# EAGLE design W077 (EAGLE 4.11)
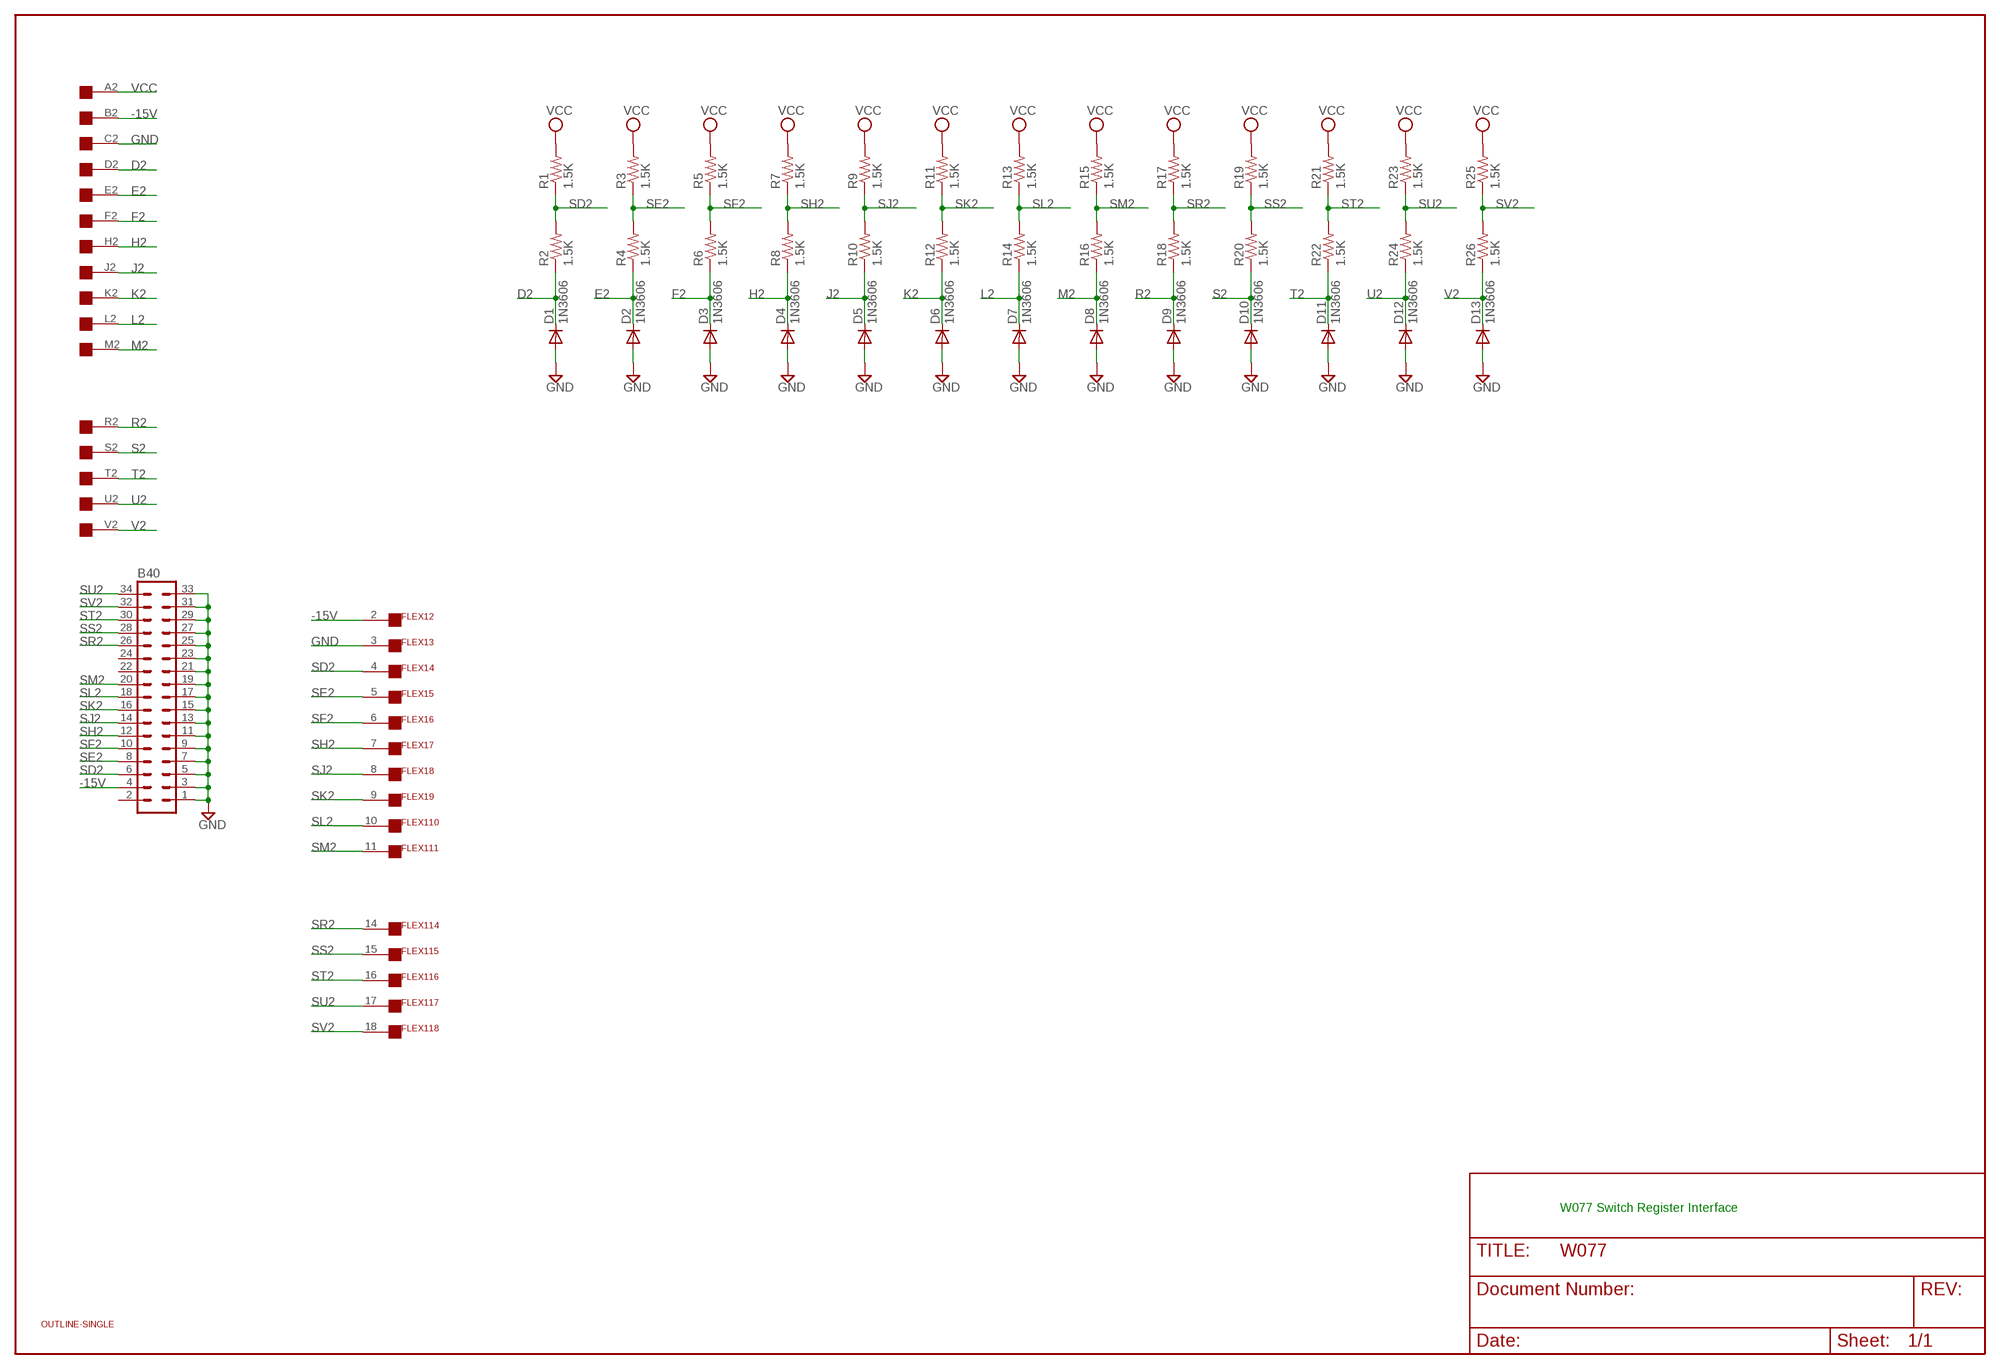
[diagram p0: schematic, sheet 1]

## Parts
B40  MA17-2  [MA17-2]
D1  1N3606  1N4148  [DO35-10]
D2  1N3606  1N4148  [DO35-10]
D3  1N3606  1N4148  [DO35-10]
D4  1N3606  1N4148  [DO35-10]
D5  1N3606  1N4148  [DO35-10]
D6  1N3606  1N4148  [DO35-10]
D7  1N3606  1N4148  [DO35-10]
D8  1N3606  1N4148  [DO35-10]
D9  1N3606  1N4148  [DO35-10]
D10  1N3606  1N4148  [DO35-10]
D11  1N3606  1N4148  [DO35-10]
D12  1N3606  1N4148  [DO35-10]
D13  1N3606  1N4148  [DO35-10]
FLEX1  FLEX19  [FLEX19]
R1  1.5K  R-US_0207/10  [0207/10]
R2  1.5K  R-US_0207/10  [0207/10]
R3  1.5K  R-US_0207/10  [0207/10]
R4  1.5K  R-US_0207/10  [0207/10]
R5  1.5K  R-US_0207/10  [0207/10]
R6  1.5K  R-US_0207/10  [0207/10]
R7  1.5K  R-US_0207/10  [0207/10]
R8  1.5K  R-US_0207/10  [0207/10]
R9  1.5K  R-US_0207/10  [0207/10]
R10  1.5K  R-US_0207/10  [0207/10]
R11  1.5K  R-US_0207/10  [0207/10]
R12  1.5K  R-US_0207/10  [0207/10]
R13  1.5K  R-US_0207/10  [0207/10]
R14  1.5K  R-US_0207/10  [0207/10]
R15  1.5K  R-US_0207/10  [0207/10]
R16  1.5K  R-US_0207/10  [0207/10]
R17  1.5K  R-US_0207/10  [0207/10]
R18  1.5K  R-US_0207/10  [0207/10]
R19  1.5K  R-US_0207/10  [0207/10]
R20  1.5K  R-US_0207/10  [0207/10]
R21  1.5K  R-US_0207/10  [0207/10]
R22  1.5K  R-US_0207/10  [0207/10]
R23  1.5K  R-US_0207/10  [0207/10]
R24  1.5K  R-US_0207/10  [0207/10]
R25  1.5K  R-US_0207/10  [0207/10]
R26  1.5K  R-US_0207/10  [0207/10]
U$1  OUTLINE-SINGLE  [SINGLE]
U$2  EDGE-1  [EDGE-CON1]

## Nets
-15V [supply]: B40.4 FLEX1.2 U$2.B2
D2: D1.C R2.1 U$2.D2
E2: D2.C R4.1 U$2.E2
F2: D3.C R6.1 U$2.F2
GND [supply]: B40.1 B40.3 B40.5 B40.7 B40.9 B40.11 B40.13 B40.15 B40.17 B40.19 B40.21 B40.23 B40.25 B40.27 B40.29 B40.31 B40.33 D1.A D2.A D3.A D4.A D5.A D6.A D7.A D8.A D9.A D10.A D11.A D12.A D13.A FLEX1.3 U$2.C2
H2: D4.C R8.1 U$2.H2
J2: D5.C R10.1 U$2.J2
K2: D6.C R12.1 U$2.K2
L2: D7.C R14.1 U$2.L2
M2: D8.C R16.1 U$2.M2
R2: D9.C R18.1 U$2.R2
S2: D10.C R20.1 U$2.S2
SD2: B40.6 FLEX1.4 R1.1 R2.2
SE2: B40.8 FLEX1.5 R3.1 R4.2
SF2: B40.10 FLEX1.6 R5.1 R6.2
SH2: B40.12 FLEX1.7 R7.1 R8.2
SJ2: B40.14 FLEX1.8 R9.1 R10.2
SK2: B40.16 FLEX1.9 R11.1 R12.2
SL2: B40.18 FLEX1.10 R13.1 R14.2
SM2: B40.20 FLEX1.11 R15.1 R16.2
SR2: B40.26 FLEX1.14 R17.1 R18.2
SS2: B40.28 FLEX1.15 R19.1 R20.2
ST2: B40.30 FLEX1.16 R21.1 R22.2
SU2: B40.34 FLEX1.17 R23.1 R24.2
SV2: B40.32 FLEX1.18 R25.1 R26.2
T2: D11.C R22.1 U$2.T2
U2: D12.C R24.1 U$2.U2
V2: D13.C R26.1 U$2.V2
VCC: R1.2 R3.2 R5.2 R7.2 R9.2 R11.2 R13.2 R15.2 R17.2 R19.2 R21.2 R23.2 R25.2 U$2.A2
Unconnected: B40.2 B40.22 B40.24 FLEX1.1 FLEX1.12 FLEX1.13 FLEX1.19 U$2.N2 U$2.P2

## Notes on the sheet
- W077 Switch Register Interface

## Library data of the parts
B40 = con-lstb:MA17-2: PIN HEADER
D1-D13 = diode:1N4148: DIODE high speed (Philips)
FLEX1 = dec-con:FLEX19
R1-R26 = rcl:R-US_: RESISTOR, American symbol
U$1 = dec-con:OUTLINE-*: Board outlines for DEC boards.
U$2 = dec-con:EDGE-1: Single-Sided DEC Edge Connector -- (side 2)

## Net classes
1 supply: width 0.762 mm

## Board
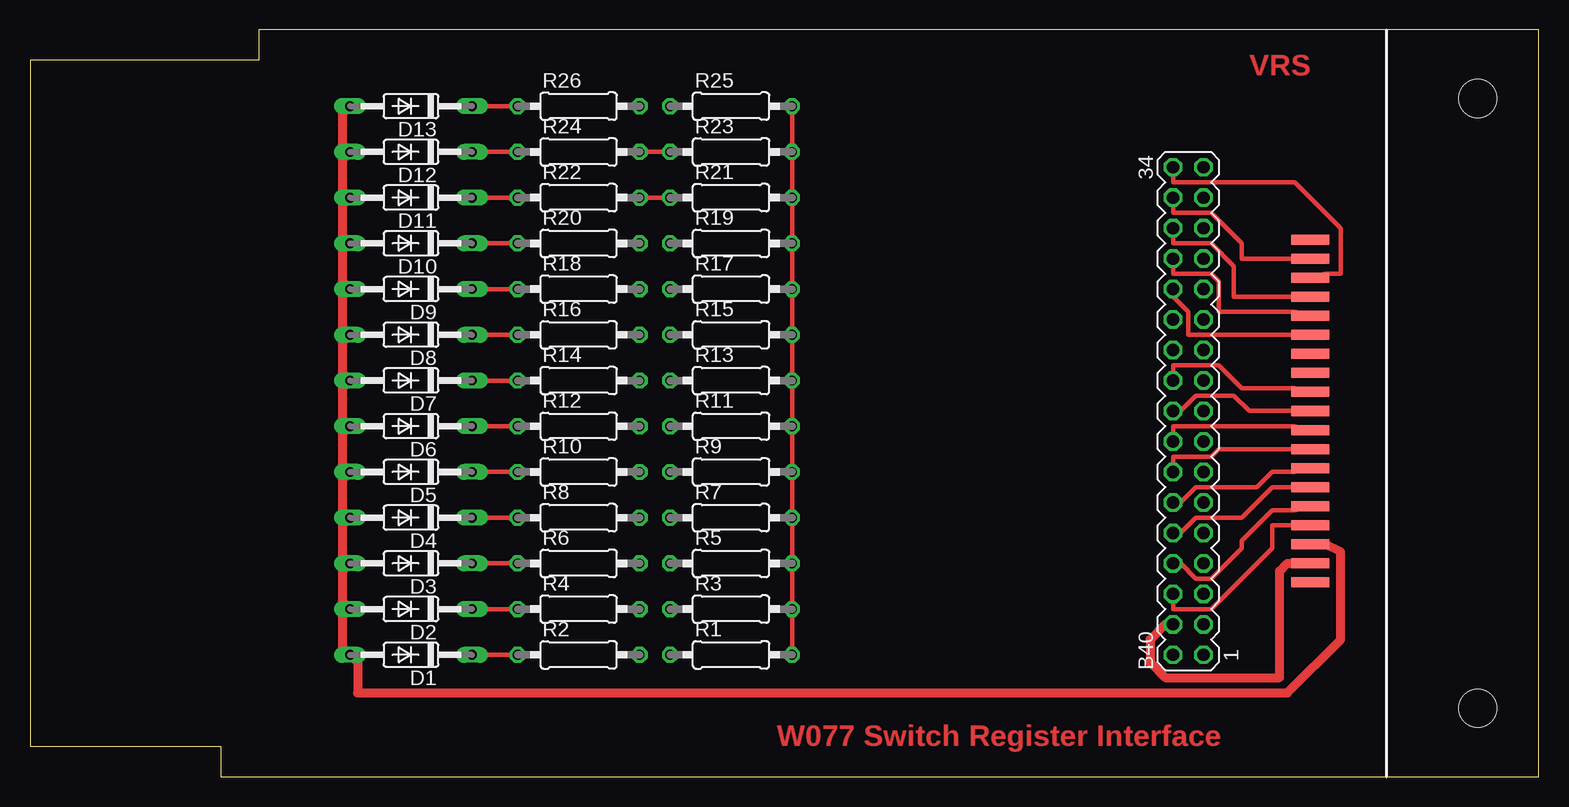
[diagram p1: board, top side]
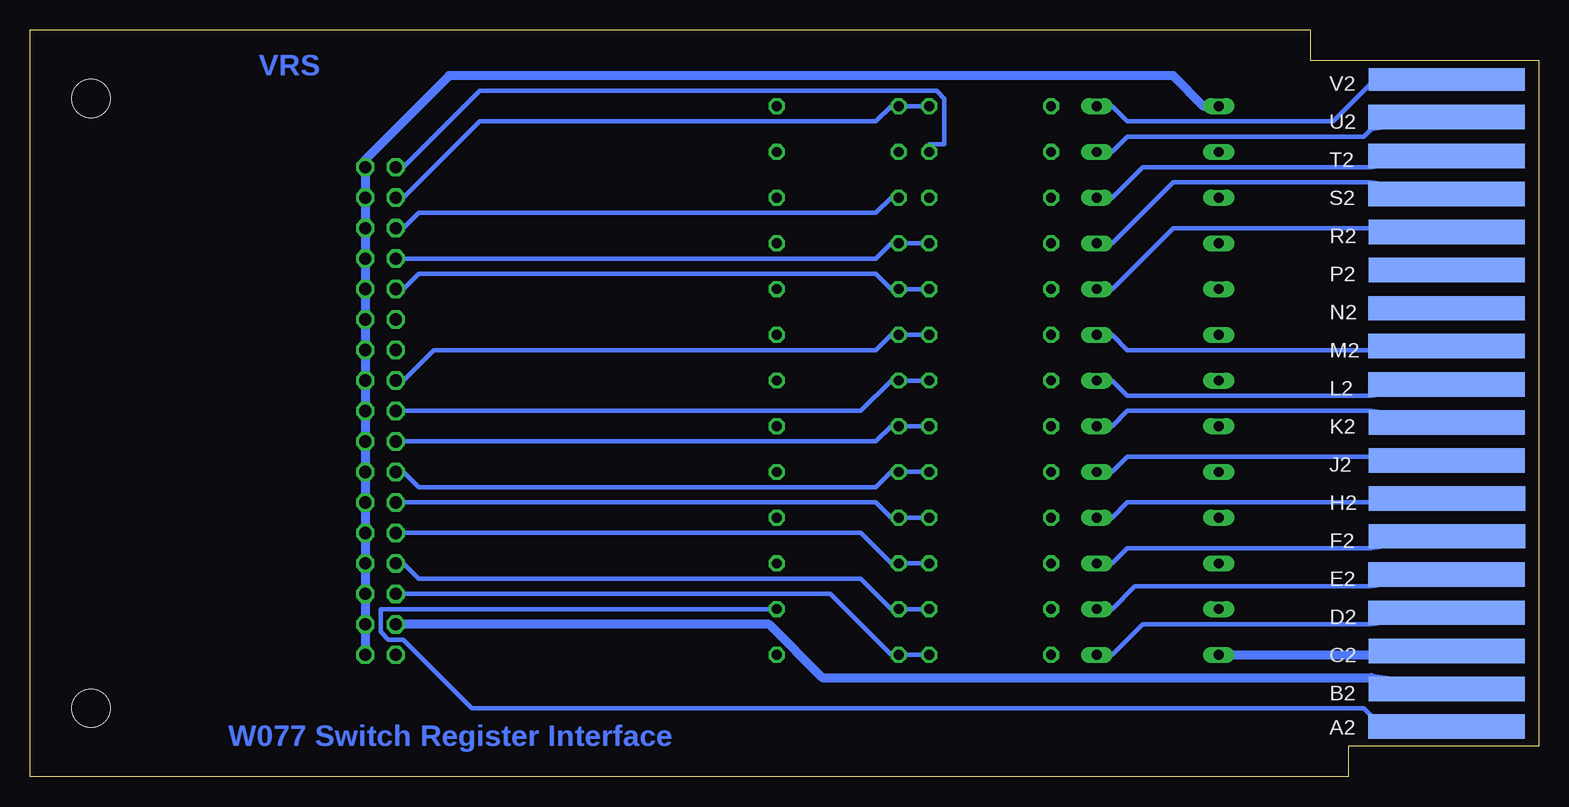
[diagram p2: board, bottom side, seen from below]

Size 125.73 x 62.23 mm. Coordinates in mm from the lower left corner, seen from the top.
Copper layers (1*16): Top 0.035mm / dielectric 1.5mm / Bottom 0.035mm
Design rules "15mils": minimum track width 15mil, minimum drill 24mil, track to track 15mil, track to pad 10mil, pad to pad 10mil, via to via 10mil, smd to smd 10mil, copper to edge 25mil, drill to drill 10mil, minimum pad ring 10mil, minimum via ring 8mil, stop-mask expansion 0mil, vias tented up to drill 0mil, thermal gap 10mil

### Footprints (pad centres in the part's own frame; a part is rotated, then mirrored left to right if it is on the bottom)
MA17-2 = drill 1.016 octagon: 1 -20.32,-1.27; 2 -20.32,1.27; 3 -17.78,-1.27; 4 -17.78,1.27; 5 -15.24,-1.27; 6 -15.24,1.27; 7 -12.7,-1.27; 8 -12.7,1.27; 9 -10.16,-1.27; 10 -10.16,1.27; 11 -7.62,-1.27; 12 -7.62,1.27; 13 -5.08,-1.27; 14 -5.08,1.27; 15 -2.54,-1.27; 16 -2.54,1.27; 17 0,-1.27; 18 0,1.27; 19 2.54,-1.27; 20 2.54,1.27; 21 5.08,-1.27; 22 5.08,1.27; 23 7.62,-1.27; 24 7.62,1.27; 25 10.16,-1.27; 26 10.16,1.27; 27 12.7,-1.27; 28 12.7,1.27; 29 15.24,-1.27; 30 15.24,1.27; 31 17.78,-1.27; 32 17.78,1.27; 33 20.32,-1.27; 34 20.32,1.27
DO35-10 = drill 0.813 long: A 5.08,0; C -5.08,0
FLEX19 = smd 3.175 x 0.838: 1 0,14.287; 2 0,12.7; 3 0,11.113; 4 0,9.525; 5 0,7.938; 6 0,6.35; 7 0,4.763; 8 0,3.175; 9 0,1.587; 10 0,0; 11 0,-1.587; 12 0,-3.175; 13 0,-4.763; 14 0,-6.35; 15 0,-7.938; 16 0,-9.525; 17 0,-11.113; 18 0,-12.7; 19 0,-14.287
0207/10 = drill 0.813 octagon: 1 -5.08,0; 2 5.08,0
SINGLE = hole 3.175: 120.65,56.515; 120.65,5.715
EDGE-CON1 = smd 13.017 x 2.032 bottom: A2 7.69,4.194; B2 7.668,7.328; C2 7.668,10.49; D2 7.693,13.665; E2 7.693,16.84; F2 7.642,20.041; H2 7.642,23.19; J2 7.668,26.34; K2 7.668,29.515; L2 7.693,32.69; M2 7.693,35.89; N2 7.693,39.04; P2 7.668,42.24; R2 7.668,45.39; S2 7.693,48.565; T2 7.693,51.74; U2 7.693,54.966 | smd 13.017 x 1.905 bottom: V2 7.668,58.102

### Placement (x,y rotation side)
B40  96.52,30.48 90 top
D1  31.75,10.16 180 top
D2  31.75,13.97 180 top
D3  31.75,17.78 180 top
D4  31.75,21.59 180 top
D5  31.75,25.4 180 top
D6  31.75,29.21 180 top
D7  31.75,33.02 180 top
D8  31.75,36.83 180 top
D9  31.75,40.64 180 top
D10  31.75,44.45 180 top
D11  31.75,48.26 180 top
D12  31.75,52.07 180 top
D13  31.75,55.88 180 top
FLEX1  106.68,30.48 180 top
R1  58.42,10.16 0 top
R2  45.72,10.16 0 top
R3  58.42,13.97 0 top
R4  45.72,13.97 0 top
R5  58.42,17.78 0 top
R6  45.72,17.78 0 top
R7  58.42,21.59 0 top
R8  45.72,21.59 0 top
R9  58.42,25.4 0 top
R10  45.72,25.4 0 top
R11  58.42,29.21 0 top
R12  45.72,29.21 0 top
R13  58.42,33.02 0 top
R14  45.72,33.02 0 top
R15  58.42,36.83 0 top
R16  45.72,36.83 0 top
R17  58.42,40.64 0 top
R18  45.72,40.64 0 top
R19  58.42,44.45 0 top
R20  45.72,44.45 0 top
R21  58.42,48.26 0 top
R22  45.72,48.26 0 top
R23  58.42,52.07 0 top
R24  45.72,52.07 0 top
R25  58.42,55.88 0 top
R26  45.72,55.88 0 top
U$1  0,0 0 top
U$2  0,0 0 top

### Tracks (layer width: path | path; a pad name or v marks a point on that pad's centre or on a via)
-15V
  Top 0.762: B40.4 94.62,12.7 93.35,11.43 93.35,9.53 94.62,8.26 104.14,8.26 104.14,17.14 104.78,17.78 105.41,17.78 FLEX1.2
  Bottom 0.762: B40.4 94.62,12.7 64.14,12.7 59.69,8.26 13.97,8.26 U$2.B2
D2
  Top 0.381: D1.C 38.1,10.16 40.01,10.16 R2.1
  Bottom 0.381: D1.C 35.56,10.16 33.02,12.7 13.97,12.7 U$2.D2
E2
  Top 0.381: D2.C 38.1,13.97 40.01,13.97 R4.1
  Bottom 0.381: D2.C 35.56,13.97 33.66,15.88 13.97,15.88 U$2.E2
F2
  Top 0.381: D3.C 38.1,17.78 40.01,17.78 R6.1
  Bottom 0.381: D3.C 35.56,17.78 34.29,19.05 13.97,19.05 U$2.F2
GND
  Top 0.762: D13.A 26.04,55.24 26.04,52.7 D12.A 26.04,51.44 26.04,48.9 D11.A 26.04,47.62 26.04,45.09 D10.A 26.04,43.81 26.04,41.27 D9.A 26.04,40.01 26.04,37.47 D8.A 26.04,36.2 26.04,33.66 D7.A 26.04,32.38 26.04,29.84 D6.A 26.04,28.57 26.04,26.04 D5.A 26.04,24.77 26.04,22.23 D4.A 26.04,20.95 26.04,18.41 D3.A 26.04,17.14 26.04,14.61 D2.A 26.04,13.34 26.04,10.79 D1.A 27.31,9.53 27.31,6.99 104.78,6.99 109.22,11.43 109.22,18.73 107.95,19.37 FLEX1.3
  Bottom 0.762: B40.1 97.79,10.79 97.79,12.06 B40.3 97.79,13.34 97.79,13.97 97.79,14.61 B40.5 97.79,15.88 97.79,17.14 B40.7 97.79,18.41 97.79,19.68 B40.9 97.79,20.95 97.79,22.23 B40.11 97.79,23.5 97.79,24.77 B40.13 97.79,26.04 97.79,27.3 B40.15 97.79,28.57 97.79,29.84 B40.17 97.79,31.11 97.79,32.38 B40.19 97.79,33.66 97.79,34.92 B40.21 97.79,36.2 97.79,37.47 B40.23 97.79,38.73 97.79,40.01 B40.25 97.79,41.27 97.79,42.55 B40.27 97.79,43.81 97.79,45.09 B40.29 97.79,46.35 97.79,47.62 B40.31 97.79,48.9 97.79,50.16 B40.33 97.79,51.44 90.81,58.42 30.48,58.42 27.94,55.88 D13.A | U$2.C2 13.97,10.16 25.4,10.16 D1.A
H2
  Top 0.381: D4.C 38.1,21.59 40.01,21.59 R8.1
  Bottom 0.381: D4.C 35.56,21.59 34.29,22.86 13.97,22.86 U$2.H2
J2
  Top 0.381: D5.C 38.1,25.4 40.01,25.4 R10.1
  Bottom 0.381: D5.C 35.56,25.4 34.29,26.67 13.97,26.67 U$2.J2
K2
  Top 0.381: D6.C 38.1,29.21 40.01,29.21 R12.1
  Bottom 0.381: D6.C 35.56,29.21 34.29,30.48 13.97,30.48 U$2.K2
L2
  Top 0.381: D7.C 38.1,33.02 40.01,33.02 R14.1
  Bottom 0.381: D7.C 35.56,33.02 34.29,31.75 13.97,31.75 U$2.L2
M2
  Top 0.381: D8.C 38.1,36.83 40.01,36.83 R16.1
  Bottom 0.381: D8.C 35.56,36.83 34.29,35.56 13.97,35.56 U$2.M2
R2
  Top 0.381: D9.C 38.1,40.64 40.01,40.64 R18.1
  Bottom 0.381: D9.C 35.56,40.64 30.48,45.72 13.97,45.72 U$2.R2
S2
  Top 0.381: D10.C 38.1,44.45 40.01,44.45 R20.1
  Bottom 0.381: D10.C 35.56,44.45 30.48,49.53 13.97,49.53 U$2.S2
SD2
  Top 0.381: FLEX1.4 105.41,20.95 103.51,20.95 103.51,19.05 98.43,13.97 95.25,13.97 95.25,14.61 B40.6
  Bottom 0.381: R2.2 51.44,10.16 52.71,10.16 R1.1 53.98,10.16 59.06,15.24 94.62,15.24 B40.6
SE2
  Top 0.381: B40.8 95.89,17.78 97.16,16.51 98.43,16.51 100.97,19.05 100.97,19.68 103.51,22.23 105.41,22.23 FLEX1.5
  Bottom 0.381: R4.2 51.44,13.97 52.71,13.97 R3.1 53.98,13.97 56.52,16.51 93.35,16.51 94.62,17.78 B40.8
SF2
  Top 0.381: B40.10 95.89,20.32 97.16,21.59 100.97,21.59 103.51,24.13 105.41,24.13 FLEX1.6
  Bottom 0.381: R6.2 51.44,17.78 52.71,17.78 R5.1 53.98,17.78 56.52,20.32 94.62,20.32 B40.10
SH2
  Top 0.381: B40.12 95.89,22.86 97.16,24.13 102.24,24.13 103.51,25.4 105.41,25.4 FLEX1.7
  Bottom 0.381: R8.2 51.44,21.59 52.71,21.59 R7.1 53.98,21.59 55.25,22.86 94.62,22.86 B40.12
SJ2
  Top 0.381: FLEX1.8 105.41,27.3 99.06,27.3 98.43,26.67 95.25,26.67 95.25,26.04 B40.14
  Bottom 0.381: R10.2 51.44,25.4 52.71,25.4 R9.1 53.98,25.4 55.25,24.13 93.35,24.13 94.62,25.4 B40.14
SK2
  Top 0.381: FLEX1.9 105.41,29.21 95.25,29.21 95.25,28.57 B40.16
  Bottom 0.381: R12.2 51.44,29.21 52.71,29.21 R11.1 53.98,29.21 55.25,27.94 94.62,27.94 B40.16
SL2
  Top 0.381: B40.18 95.89,30.48 97.16,31.75 100.33,31.75 101.6,30.48 105.41,30.48 FLEX1.10
  Bottom 0.381: R14.2 51.44,33.02 52.71,33.02 R13.1 53.98,33.02 56.52,30.48 94.62,30.48 B40.18
SM2
  Top 0.381: FLEX1.11 105.41,32.38 100.97,32.38 99.06,34.29 95.25,34.29 95.25,33.66 B40.20
  Bottom 0.381: R16.2 51.44,36.83 52.71,36.83 R15.1 53.98,36.83 55.25,35.56 92.08,35.56 94.62,33.02 B40.20
SR2
  Top 0.381: FLEX1.14 105.41,36.83 96.52,36.83 96.52,38.73 95.25,40.01 B40.26
  Bottom 0.381: R18.2 51.44,40.64 52.71,40.64 R17.1 53.98,40.64 55.25,41.91 93.35,41.91 94.62,40.64 B40.26
SS2
  Top 0.381: FLEX1.15 105.41,38.73 99.06,38.73 99.06,41.27 98.43,41.91 95.25,41.91 95.25,42.55 B40.28
  Bottom 0.381: R20.2 51.44,44.45 52.71,44.45 R19.1 53.98,44.45 55.25,43.18 94.62,43.18 B40.28
ST2
  Top 0.381: R22.2 51.44,48.26 52.71,48.26 R21.1 | FLEX1.16 105.41,40.01 100.33,40.01 100.33,42.55 98.43,44.45 95.25,44.45 95.25,45.09 B40.30
  Bottom 0.381: B40.30 94.62,45.72 93.35,46.99 55.25,46.99 53.98,48.26 R21.1
SU2
  Top 0.381: R23.1 52.71,52.07 51.44,52.07 R24.2 | FLEX1.17 107.95,41.91 109.22,41.91 109.22,45.72 105.41,49.53 95.25,49.53 95.25,50.16 B40.34
  Bottom 0.381: B40.34 94.62,50.8 88.27,57.15 50.17,57.15 49.53,56.52 49.53,52.7 50.8,52.7 R24.2
SV2
  Top 0.381: FLEX1.18 105.41,43.18 100.97,43.18 100.97,44.45 98.43,46.99 95.25,46.99 95.25,47.62 B40.32
  Bottom 0.381: R26.2 51.44,55.88 52.71,55.88 R25.1 53.98,55.88 55.25,54.61 88.27,54.61 94.62,48.26 B40.32
T2
  Top 0.381: D11.C 38.1,48.26 40.01,48.26 R22.1
  Bottom 0.381: D11.C 35.56,48.26 33.02,50.8 13.97,50.8 U$2.T2
U2
  Top 0.381: D12.C 38.1,52.07 40.01,52.07 R24.1
  Bottom 0.381: D12.C 35.56,52.07 34.29,53.34 14.61,53.34 13.97,53.98 U$2.U2
V2
  Top 0.381: D13.C 38.1,55.88 40.01,55.88 R26.1
  Bottom 0.381: D13.C 35.56,55.88 34.29,54.61 17.15,54.61 13.97,57.78 U$2.V2
VCC
  Top 0.381: R1.2 63.5,10.79 63.5,13.34 R3.2 63.5,14.61 63.5,17.14 R5.2 63.5,18.41 63.5,20.95 R7.2 63.5,22.23 63.5,24.77 R9.2 63.5,26.04 63.5,28.57 R11.2 63.5,29.84 63.5,32.38 R13.2 63.5,33.66 63.5,36.2 R15.2 63.5,37.47 63.5,40.01 R17.2 63.5,41.27 63.5,43.81 R19.2 63.5,45.09 63.5,47.62 R21.2 63.5,48.9 63.5,51.44 R23.2 63.5,52.7 63.5,55.24 R25.2
  Bottom 0.381: U$2.A2 13.97,5.08 14.61,5.71 88.9,5.71 94.62,11.43 95.89,11.43 96.52,12.06 96.52,13.97 64.14,13.97 R3.2

### Text on the board
Top: VRS | W077 Switch Register Interface
Bottom: VRS | W077 Switch Register Interface